# Altium schematic sheet Relay_IO.SchDoc: 12V Solenoid Relay Logic
size 431 x 279 mm; Engineer: S Circuit; DocumentNumber: 4; Revision: 1.2; SheetNumber: 4; SheetTotal: 5
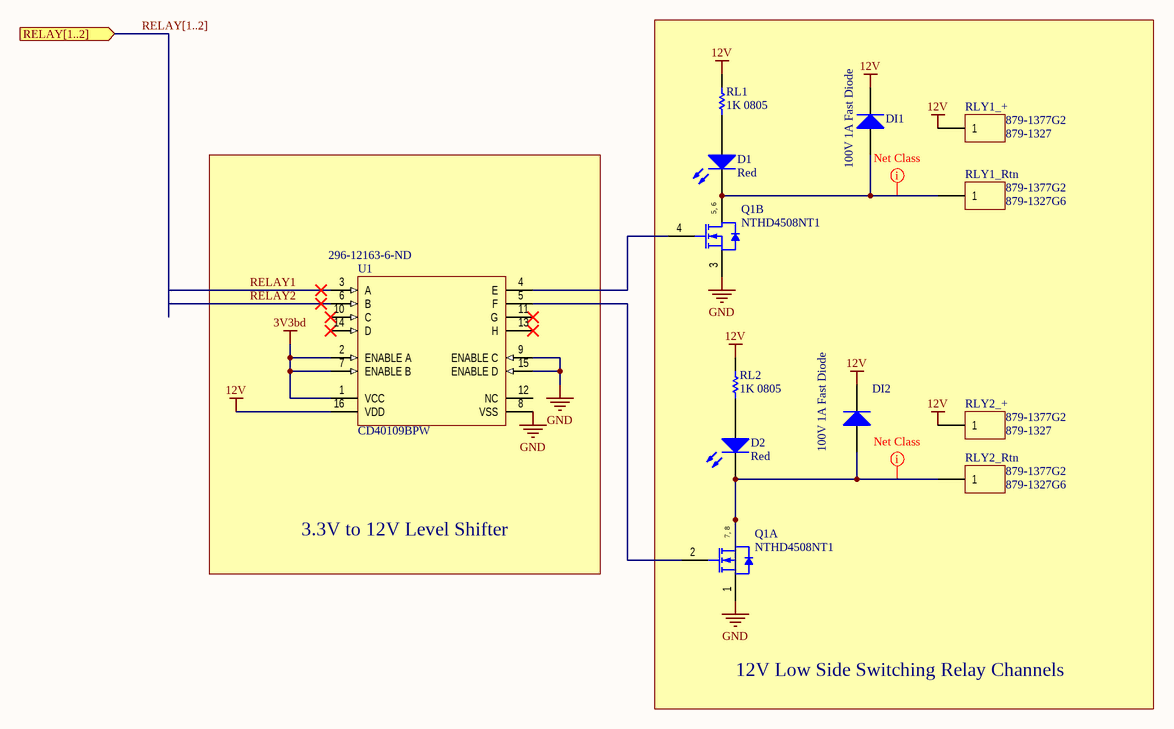
[diagram p0: Relay_IO.SchDoc]

## Parts
D1  Color: Red  [0603_A]  (hidden comment: LED Red)
D2  Color: Red  [0603_A]  (hidden comment: LED Red)
DI1  100V 1A Fast Diode  [DO-35]
DI2  100V 1A Fast Diode  [DO-35]
Q1  NTHD4508NT1  [ONSC-CHIPFET-8-1206A-03_S2_V]  (parts A,B of 2)
RL1  1K 0805  [0805_L]
RL2  1K 0805  [0805_L]
RLY1_+  Supplier Part Number 1: 879-1377G2  Supplier Part Number 2: 879-1327  [Anderson_Red_RHT_BOT]  (hidden comment: Anderson-1Pin RED_PCB_RHT)
RLY1_Rtn  Supplier Part Number 1: 879-1377G2  Supplier Part Number 2: 879-1327G6  [Anderson_BLK_RHT_BOT]  (hidden comment: Anderson-1Pin BLK_PCB_RHT)
RLY2_+  Supplier Part Number 1: 879-1377G2  Supplier Part Number 2: 879-1327  [Anderson_Red_RHT_BOT]  (hidden comment: Anderson-1Pin RED_PCB_RHT)
RLY2_Rtn  Supplier Part Number 1: 879-1377G2  Supplier Part Number 2: 879-1327G6  [Anderson_BLK_RHT_BOT]  (hidden comment: Anderson-1Pin BLK_PCB_RHT)
U1  CD40109BPW  Supplier Part Number 1: 296-12163-6-ND  [PW0016A_M]

## Blocks framed on the sheet
12V Low Side Switching Relay Channels: D1 D2 DI1 DI2 Q1 RL1 RL2 RLY1_+ RLY1_Rtn RLY2_+ RLY2_Rtn
3.3V to 12V Level Shifter: U1

## Ports
RELAY[1..2] (in)

## Nets
3V3bd: U1.1(VCC) U1.2(ENABLE_A) U1.7(ENABLE_B)
12V: DI1.2(K) DI2.2(K) RL1.2 RL2.2 RLY1_+.1 RLY2_+.1 U1.16(VDD)
GND: Q1.1(S1) Q1.3(S2) U1.8(VSS) U1.9(ENABLE_C) U1.15(ENABLE_D)
RELAY1: U1.3(A)
RELAY2: U1.6(B)
NetD1_1: D1.1(K) DI1.1(A) Q1.5(D2) Q1.6(D2) RLY1_Rtn.1
NetD1_2: D1.2(A) RL1.1
NetD2_1: D2.1(K) DI2.1(A) Q1.7(D1) Q1.8(D1) RLY2_Rtn.1
NetD2_2: D2.2(A) RL2.1
NetQ1_2: Q1.2(G1) U1.5(F)
NetQ1_4: Q1.4(G2) U1.4(E)

Not connected (* = marked no-connect by the designer): U1 10(C)* 11(G)* 12(NC) 13(H)* 14(D)*

## Buses and harness runs
bus RELAY[1..2] = port RELAY[1..2]

## Layout directives
net class PowerNets: NetD1_1, NetD2_1

## Notes on the sheet
- 8
- 7
- 6
- 5
- 4
- 3
- DWG. NO.
- REV.
- SHT.
- 2
- 1
- THIS DOCUMENT AND THE DATA DISCLOSED HEREIN OR HEREWITH IS THE PROPERTY OF ALTIUM LIMITED AND MAY BE FREELY DISTRIBUTED IN WHOLE. NO RIGHTS ARE RESERVED OR EXPRESS OR IMPLIED WARANTEE GIVEN.
- REVISION
- DESCRIPTION
- DATE
- APPROVED
- F
- E
- D
- C
- B
- ENG:
- APPROVALS
- PROJECT
- A
- DSN:
- CHK:
- REFERENCE DOCUMENTS
- PROJECT REVISION:
- TITLE
- DOCUMENT REVISION:
- DESIGN ITEM:
- BOM:
- FAB DWG:
- PCB DWG:
- ASSY DWG:
- SCALE:
- SIZE
- CAGE CODE
- FILE NAME
- DWG NO.
- SHEET
- OF
- REV
- (in symbol NTHD4508NT1, part A) 7, 8
- (in symbol NTHD4508NT1, part B) 5, 6

## Library data of the parts
D1 D2 = LED_Red0603: SMD mono-color Chip LED, WL-SMCW, Red; Manufacturer: Wurth Electronics Inc; Manufacturer Part Number: 150060RS75000; Lens Color: Colorless; Lens Transparency: Clear; Millicandela Rating: 250mcd; Lens Style/Size: Rectangle with Flat Top, 1.10mm x 0.70mm; Voltage - Forward (Vf) (Typ): 2V; Current - Test: 20mA; Viewing Angle: 140°; Wavelength - Dominant: 625nm; Wavelength - Peak: 630nm; ComponentLink1URL: http://katalog.we-online.de/led/datasheet/150060RS75000.pdf; ComponentLink1Description: http://katalog.we-online.de/led/datasheet/150060RS75000.pdf; Supplier 1: Digi-Key; Supplier Part Number 1: 732-4978-1-ND; RoHS: RoHS Compliant; Category: Optoelectronics; Stock 1: 22059; Pricing 1: 1=0.24, 50=0.21, 100=0.192, 500=0.174, 1000=0.162 (USD); Packaging: Cut Tape (CT); Mounting Type: Surface Mount; Features: -; Package / Case: 0603 (1608 Metric); Supplier Device Package: 0603; Size / Dimension: 1.60mm L x 0.80mm W; Height (Max): 0.80mm
DI1 DI2 = Diode 1N4148: High Conductance Fast Diode; Manufacturer: ON Semiconductor; Manufacturer Part Number: MUR110RLG; Diode Case Style: DO-204AL; Diode Configuration: Single; Diode Type: Fast Recovery; Forward Surge Current Ifsm Max: 35A; Forward Voltage VF Max: 1.25V; No. of Pins: 2; Reverse Recovery Time trr Max: 75ns; SVHC: No SVHC (16-Jun-2014); Supplier 1: Ciiva; Supplier Part Number 1: MUR110RLGOSCT-ND; Stock 1: 22453; Pricing 1: 1=0.48, 10=0.362, 100=0.2254, 500=0.1541, 1000=0.1185 (USD); Forward Current If(AV): 1A; Operating Temperature Max: 175°C; Packaging: Each; Repetitive Reverse Voltage Vrrm Max: 100V; ComponentLink1URL: https://datasheet.ciiva.com/915/mur120-d-915616.pdf; ComponentLink1Description: https://datasheet.ciiva.com/915/mur120-d-915616.pdf; ComponentLink2URL: https://datasheet.ciiva.com/30479/0900766b812212ee-30479481.pdf; ComponentLink2Description: https://datasheet.ciiva.com/30479/0900766b812212ee-30479481.pdf; ComponentLink3URL: https://datasheet.ciiva.com/25950/mur120-d-25950702.pdf; ComponentLink3Description: https://datasheet.ciiva.com/25950/mur120-d-25950702.pdf; ComponentLink4URL: https://datasheet.ciiva.com/16474/mur120-d-16474333.pdf; ComponentLink4Description: https://datasheet.ciiva.com/16474/mur120-d-16474333.pdf; ComponentLink5URL: https://datasheet.ciiva.com/915/mur120-d-915618.pdf; ComponentLink5Description: https://datasheet.ciiva.com/915/mur120-d-915618.pdf; ComponentLink6URL: https://datasheet.ciiva.com/915/mur120-d-915619.pdf; ComponentLink6Description: https://datasheet.ciiva.com/915/mur120-d-915619.pdf; ComponentLink7URL: https://datasheet.ciiva.com/16208/mur120-d-16208137.pdf; ComponentLink7Description: https://datasheet.ciiva.com/16208/mur120-d-16208137.pdf
Q1 = NTHD4508NT1: Power MOSFET, 20 V, 4.1 A, Dual N-Channel, 8-Pin CHIPFET, Tape and Reel; Manufacturer: On Semiconductor; Manufacturer Part Number: NTHD4508NT1G; V(BR)DSS Min (V): 20; VGS(th) Max (V): 1.2; ID Max (A): 4.1; Ciss Typ (pF): 180; Crss Typ (pF): 25; Qrr Typ (nC): 6; Coss Typ (pF): 80; Channel Polarity: N Channel; VGS Max (V): 12; FET Type: 2 N-Channel (Dual); FET Feature: Logic Level Gate; Drain to Source Voltage (Vdss): 20V; Current - Continuous Drain (Id) @ 25°C: 3A; Rds On (Max) @ Id, Vgs: 75 mOhm @ 3.1A, 4.5V; Vgs(th) (Max) @ Id: 1.2V @ 250µA; Gate Charge (Qg) @ Vgs: 4nC @ 4.5V; Input Capacitance (Ciss) @ Vds: 180pF @ 10V; Power - Max: 1.13W; ComponentLink2URL: http://www.onsemi.com/pub_link/Collateral/NTHD4508N-D.PDF; PackageVersion: Rev. E, 10/2004; PackageReference: CHIPFET-8-1206A-03_S2; PartNumber: NTHD4508NT1; Configuration: Dual; PackageDescription: 8-Pin ChipFET, Body 3.025 x 1.625 mm, Pitch 0.635 mm; DatasheetVersion: Rev. 3; ComponentLink3Description: Package Specification; ComponentLink1URL: http://www.onsemi.com/; Package Type: ChipFET-8; ComponentLink2Description: Datasheet; Packing: Tape and Reel; ComponentLink1Description: Manufacturer URL; ComponentLink3URL: http://www.onsemi.com/pub_link/Collateral/NTHC5513-D.PDF; Mounting Technology: Surface Mount; PartId: 1; Supplier 1: Digi-Key; Supplier Part Number 1: NTHD4508NT1GOSCT-ND; RoHS: RoHS Compliant; Category: Discrete Semiconductor Products; Stock 1: 6850; Pricing 1: 1=0.53, 10=0.457, 100=0.3416, 500=0.26832, 1000=0.20685 (USD); Packaging: Cut Tape (CT); Part Status: Active; Operating Temperature: -55°C ~ 150°C (TJ); Mounting Type: Surface Mount; Package / Case: 8-SMD, Flat Lead; Supplier Device Package: ChipFET™
RL1 RL2 = Res1K_0805: Manufacturer: Panasonic Electronic Components; Manufacturer Part Number: ERJ-6GEYJ102V; Tolerance: ±5%; Power (Watts): 0.125W, 1/8W; Temperature Coefficient: ±200ppm/°C; Supplier 1: Digi-Key; RoHS: RoHS Compliant; Category: Resistors; Stock 1: 1669380; Pricing 1: 1=0.1, 50=0.015, 100=0.011, 250=0.0084, 500=0.00674, 1000=0.00496 (USD); Packaging: Cut Tape (CT); Part Status: Active; Resistance (Ohms): 1k; Composition: Thick Film; Features: Automotive AEC-Q200; Operating Temperature: -55°C ~ 155°C; Package / Case: 0805 (2012 Metric); Supplier Device Package: 0805; Size / Dimension: 0.079" L x 0.049" W (2.00mm x 1.25mm); Height: 0.028" (0.70mm); Number of Terminations: 2; Failure Rate: -; ComponentLink1URL: http://industrial.panasonic.com/www-cgi/jvcr13pz.cgi?E+PZ+3+AOA0001+ERJ6GEYJ102V+7+WW; ComponentLink1Description: http://industrial.panasonic.com/www-cgi/jvcr13pz.cgi?E+PZ+3+AOA0001+ERJ6GEYJ102V+7+WW; Supplier Part Number 1: P1.0KACT-ND
RLY1_+ RLY2_+ = Anderson-1Pin RED_PCB_RHT: 1 pin Anderson; Manufacturer: Anderson Power Products (APP); Manufacturer Part Number: 1377G1, 1377G2, 1327-BK,137G6-BK; Number of Positions / Contacts: 1; Voltage Rating: 600 V; Current Rating: 25 A; Mouser: 879-1327G6; Mouser: 879-1327; Mouser: 879-1377G2; Mouser: 879-1377G1; Supplier 1: Mouser; Stock 1: 233; Pricing 1: 1=1.14, 10=1.14, 50=0.947, 100=0.901, 1000=0.777, 10000=0.777 (USD); Termination Style: Solder; Series: PCB Powerpole; Product Type: Contacts; Contact Material: Copper Alloy; Contact Plating: Tin; ComponentLink1URL: http://components.arrow.com/part/dataview/0323_01933244; ComponentLink1Description: http://components.arrow.com/part/dataview/0323_01933244; ComponentLink2URL: http://www.andersonpower.com/files.php?file=CAT-PPMP(4).pdf; ComponentLink2Description: http://www.andersonpower.com/files.php?file=CAT-PPMP(4).pdf
RLY1_Rtn RLY2_Rtn = Anderson-1Pin BLK_PCB_RHT: 1 pin Anderson; Manufacturer: Anderson Power Products (APP); Manufacturer Part Number: 1377G1, 1377G2, 1327-BK,137G6-BK; Number of Positions / Contacts: 1; Voltage Rating: 600 V; Current Rating: 25 A; Mouser: 879-1327G6; Mouser: 879-1327; Mouser: 879-1377G2; Mouser: 879-1377G1; Supplier 1: Mouser; Stock 1: 233; Pricing 1: 1=1.14, 10=1.14, 50=0.947, 100=0.901, 1000=0.777, 10000=0.777 (USD); Termination Style: Solder; Series: PCB Powerpole; Product Type: Contacts; Contact Material: Copper Alloy; Contact Plating: Tin; ComponentLink1URL: http://components.arrow.com/part/dataview/0323_01933244; ComponentLink1Description: http://components.arrow.com/part/dataview/0323_01933244; ComponentLink2URL: http://www.andersonpower.com/files.php?file=CAT-PPMP(4).pdf; ComponentLink2Description: http://www.andersonpower.com/files.php?file=CAT-PPMP(4).pdf
U1 = CMP-1527-00010-2: CMOS Quad Low-to-High Voltage Level Shifter, 3 to 18 V, -55 to 125 degC, 16-Pin TSSOP (PW16), RoHS, Tube; Manufacturer: Texas Instruments; Manufacturer Part Number: CD40109BPWR; Number of Bits: 4; VSS: 3 to 18 V; Propagation Delay: 240 ns Max.; Logic Function: Level Shifter, 3-State; Number of Outputs/Channel: 1; Differential - Input:Output: No/No; Propagation Delay (Max): 240ns; Voltage - Supply: 3 V ~ 18 V; Dynamic Catalog: 4000B; Other Names: 296-12163-6; PackageDescription: 16-Pin Plastic Small Outline Package, Body 5 x 4.4 mm, Pitch 0.65 mm; ComponentLink3URL: http://www.ti.com/lit/ml/mpds361/mpds361.pdf; Package Reference: PW0016A; ComponentLink2URL: http://www.ti.com/lit/ds/symlink/cd40109b.pdf; RoHS: TRUE; ComponentLink1URL: www.ti.com; ComponentLink1Description: Manufacturer URL; PackageVersion: 4040064-4/G; Number of Channels: 4; PartNumber: CD40109BPW; DatasheetVersion: SCHS099B; Number of Outputs: 4; ComponentLink3Description: Package Specification; ComponentLink2Description: Datasheet; Mounting Technology: Surface Mount; Packing: Tube; Temperature Range: -55 to 125 degC; Supplier 1: Digikey; Stock 1: 11025; Pricing 1: 1=0.42, 10=0.36, 100=0.2688, 500=0.2111, 1000=0.1628 (USD); Standard Package: 1; Category: Integrated Circuits (ICs); Family: Logic - Translators; Series: 4000B; Input Type: Voltage; Output Type: Voltage; Data Rate: -; Operating Temperature: -55°C ~ 125°C; Package / Case: 16-TSSOP (0.173", 4.40mm Width); Supplier Device Package: 16-TSSOP; Packaging: Digi-Reel®; ComponentLink4URL: https://datasheet.ciiva.com/1899/cd40109b-1899236.pdf; ComponentLink4Description: https://datasheet.ciiva.com/1899/cd40109b-1899236.pdf; ComponentLink5URL: https://datasheet.ciiva.com/1899/cd40109b-1899237.pdf; ComponentLink5Description: https://datasheet.ciiva.com/1899/cd40109b-1899237.pdf; ComponentLink6URL: https://datasheet.ciiva.com/1899/cd40109b-1899238.pdf; ComponentLink6Description: https://datasheet.ciiva.com/1899/cd40109b-1899238.pdf; ComponentLink7URL: https://datasheet.ciiva.com/15096/getdatasheetpartid-50246-15096137.pdf; ComponentLink7Description: https://datasheet.ciiva.com/15096/getdatasheetpartid-50246-15096137.pdf; ComponentLink8URL: https://datasheet.ciiva.com/41455/001015415-da-01-en-ic-quad-lo-hi-v-cd40109bpwr-tssop-16-tid-41455340.pdf; ComponentLink8Description: https://datasheet.ciiva.com/41455/001015415-da-01-en-ic-quad-lo-hi-v-cd40109bpwr-tssop-16-tid-41455340.pdf; ComponentLink9URL: https://datasheet.ciiva.com/3305/cd40109b-mil-3305133.pdf; ComponentLink9Description: https://datasheet.ciiva.com/3305/cd40109b-mil-3305133.pdf